# EAGLE schematic lamp pcb (EAGLE 9.7.0)
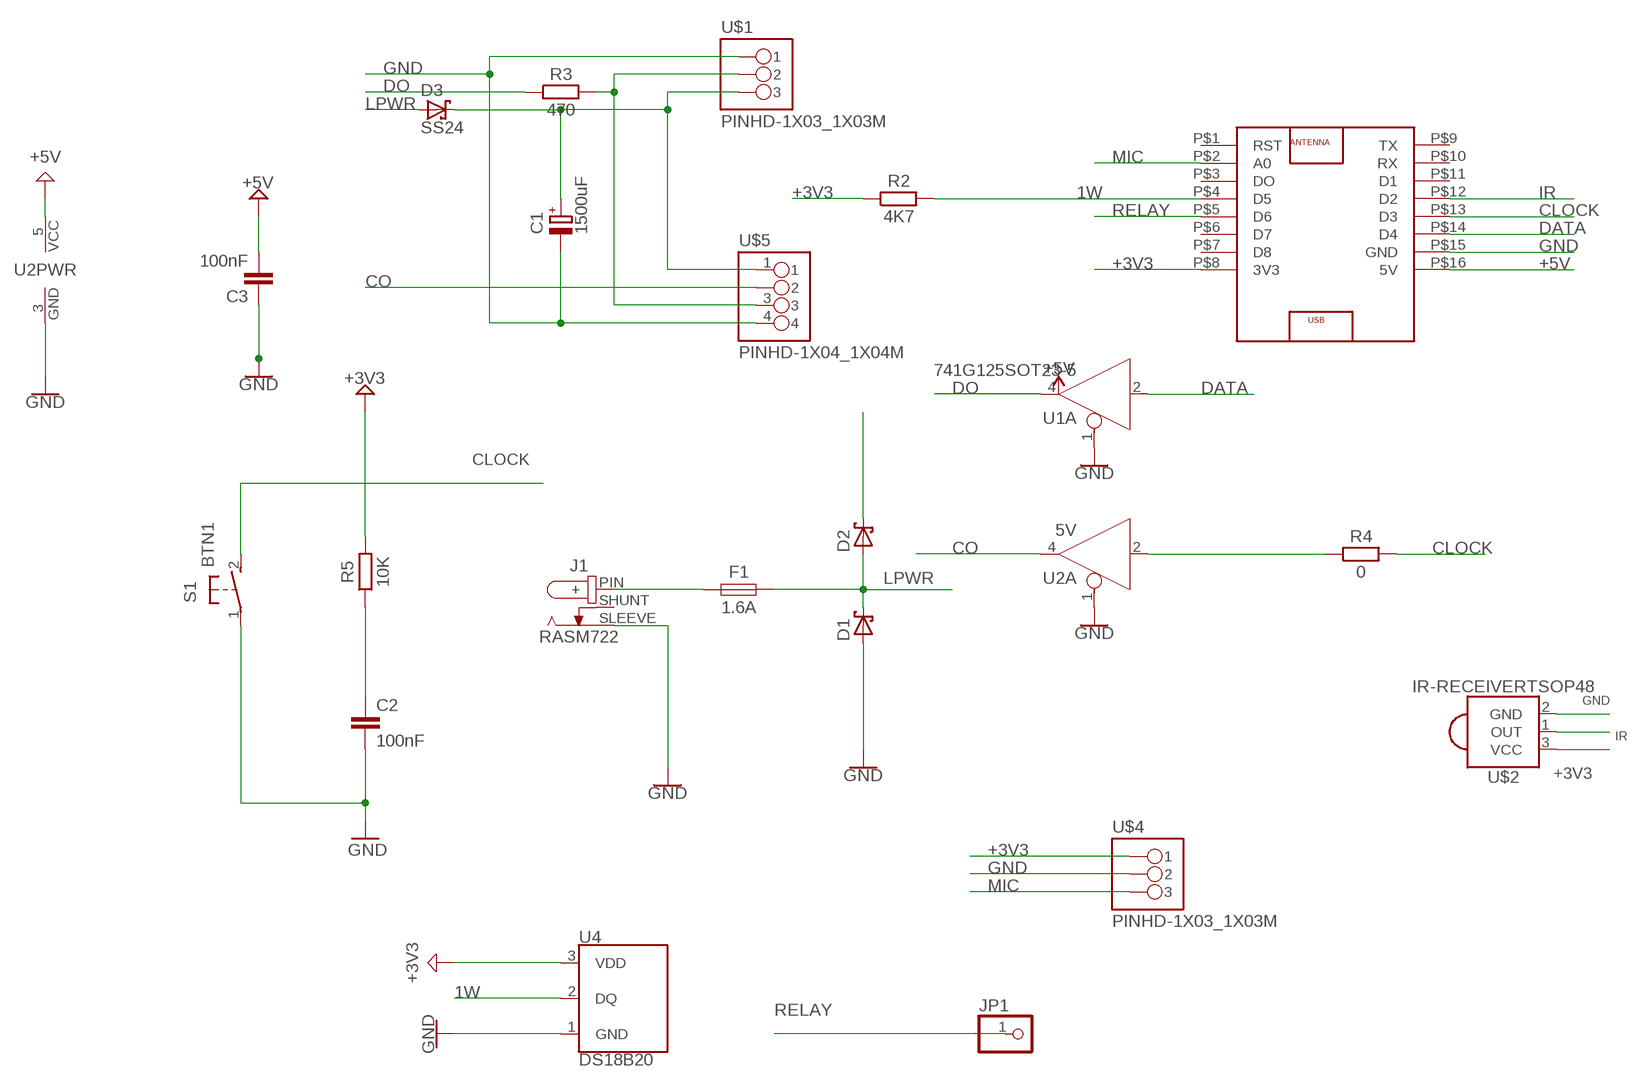
[diagram p0: schematic, sheet 1]

## Parts
C1  1500uF  CAPACITOR-POL_TANTALUM-1206(3216-METRIC)  [CAPMP3216X180N]
C2  100nF  CAPACITOR-N0402  [0402-CAP]
C3  100nF  CAPACITOR-N0402  [0402-CAP]
D1  SCHOTTKY-DIODEDO13M  [DO13M]
D2  SCHOTTKY-DIODEDO13M  [DO13M]
D3  SS24  SCHOTTKY-DIODEDO13M  [DO13M]
F1  1.6A  FUSE_AXIAL-26MM-PITCH  [FUSAD2590W70L2150D550B]
J1  RASM722  [RASM722X]
JP1  PINHD-1X1  [1X01]
R2  4K7  RESISTOR__CHIP-0402(1005-METRIC)  [RESC1005X40]
R3  470  RESISTOR__CHIP-0402(1005-METRIC)  [RESC1005X40]
R4  0  RESISTOR__CHIP-0402(1005-METRIC)  [RESC1005X40]
R5  10K  RESISTOR__CHIP-0402(1005-METRIC)  [RESC1005X40]
S1  BTN1  31-XX  [B3F-31XX]
U1  741G125SOT23-5  [SOT23-5]
U2  5V  741G125SOT23-5  [SOT23-5]
U4  DS18B20  [TO-92-AMMO]
U$1  PINHD-1X03_1X03M  [1X03]
U$2  IR-RECEIVERTSOP48  [TSOP48]
U$4  PINHD-1X03_1X03M  [1X03]
U$5  PINHD-1X04_1X04M  [1X04]
U$6  WEMOS-D1-MINI  [WEMOS-PACKAGE]

## Nets
1W: R2.2 U4.2(DQ) U$6.P$4(D5)
+3V3: R2.1 R5.2 U4.3(VDD) U$2.3(VCC) U$4.1 U$6.P$8(3V3)
+5V: C3.2 U2.5(PWR:VCC) U$6.P$16(5V)
CLOCK: R4.2 S1.2(S) U$6.P$13(D3)
CO: U2.4(A:O) U$5.2
DATA: U1.2(A:I) U$6.P$14(D4)
DO: R3.1 U1.4(A:O)
GND: C1.2(-) C2.2 C3.1 D1.A J1.SLEEVE(NEG) S1.1(P) U1.1(A:OE) U2.1(A:OE) U2.3(PWR:GND) U4.1(GND) U$1.1 U$2.2(GND) U$4.2 U$5.4 U$6.P$15(GND)
IR: U$2.1(OUT) U$6.P$12(D2)
LPWR: D1.C D2.A D3.A F1.2
MIC: U$4.3 U$6.P$2(A0)
N$1: R4.1 U2.2(A:I)
N$2: C2.1 R5.1
N$3: D2.C
N$5: F1.1 J1.PIN(+)
N$6: R3.2 U$1.2 U$5.3
N$8: C1.1(+) D3.C U$1.3 U$5.1
RELAY: JP1.1 U$6.P$5(D6)
Unconnected: J1.SHUNT(-) U$6.P$1(RST) U$6.P$3(DO) U$6.P$6(D7) U$6.P$7(D8) U$6.P$9(TX) U$6.P$10(RX) U$6.P$11(D1)

## Power pins joined to a net without a drawn wire
GND: U1.3(PWR:GND)
VCC: U1.5(PWR:VCC)

## Library data of the parts
C1 = Tinkercad:CAPACITOR-POL: Capacitor Polarised - Generic
C2 C3 = BeagleBone_Blue_R3:CAPACITOR-N
D1-D3 = adafruit:SCHOTTKY-DIODE: Schottky Diode
F1 = Circuit-Protection:FUSE: Fuse - Generic
J1 = Connector:RASM722: CONN PWR JACK 2.1X5.5MM SOLDER
JP1 = adafruit:PINHD-1X1: Pin header 1x1 for 0.1" spacing With round pins
R2-R5 = Tinkercad:RESISTOR: Resistor Fixed - Generic
S1 = adafruit:31-XX: OMRON SWITCH Now with beefier pads!
U1 U2 = IC_Logic:74*1G125: Single Bus Buffer Gate with 3-State Output
U4 = SparkFun-Sensors:DS18B20: Dallas/Maxim DS18B20 1-Wire Temperature Sensor The DS18B20 reports degrees C with 9 to 12-bit precision, -55C to 125C (+/-0.5C). Each sensor has a unique 64-Bit Serial number etched into it - allows for a huge number of sensors to be used on one data bus. Datasheet <http://datasheets.maximintegrated.com/en/ds/DS18B20.pdf> SparkFun Products One Wire Digital Temperature Sensor - DS18B20 <https://www.sparkfun.com/products/245> (SEN-00245)
U$1 U$4 = Tinkercad:PINHD-1X03
U$2 = Tinkercad:IR-RECEIVER
U$5 = Tinkercad:PINHD-1X04
U$6 = WEMOS-D1-MINI:WEMOS-D1-MINI